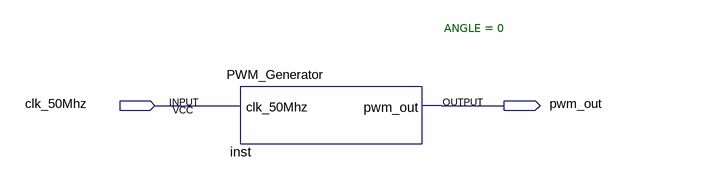
[diagram p0: schematic sheet]
// Quartus schematic schematic.bdf as structural Verilog: 1 symbols, 2 pins
module schematic (
  input  clk_50Mhz,
  output pwm_out
);

  PWM_Generator #(.ANGLE(0)) inst (.clk_50Mhz(clk_50Mhz), .pwm_out(pwm_out));
endmodule
